# EAGLE design Enable Bus Circuit (EAGLE 7.5.0)
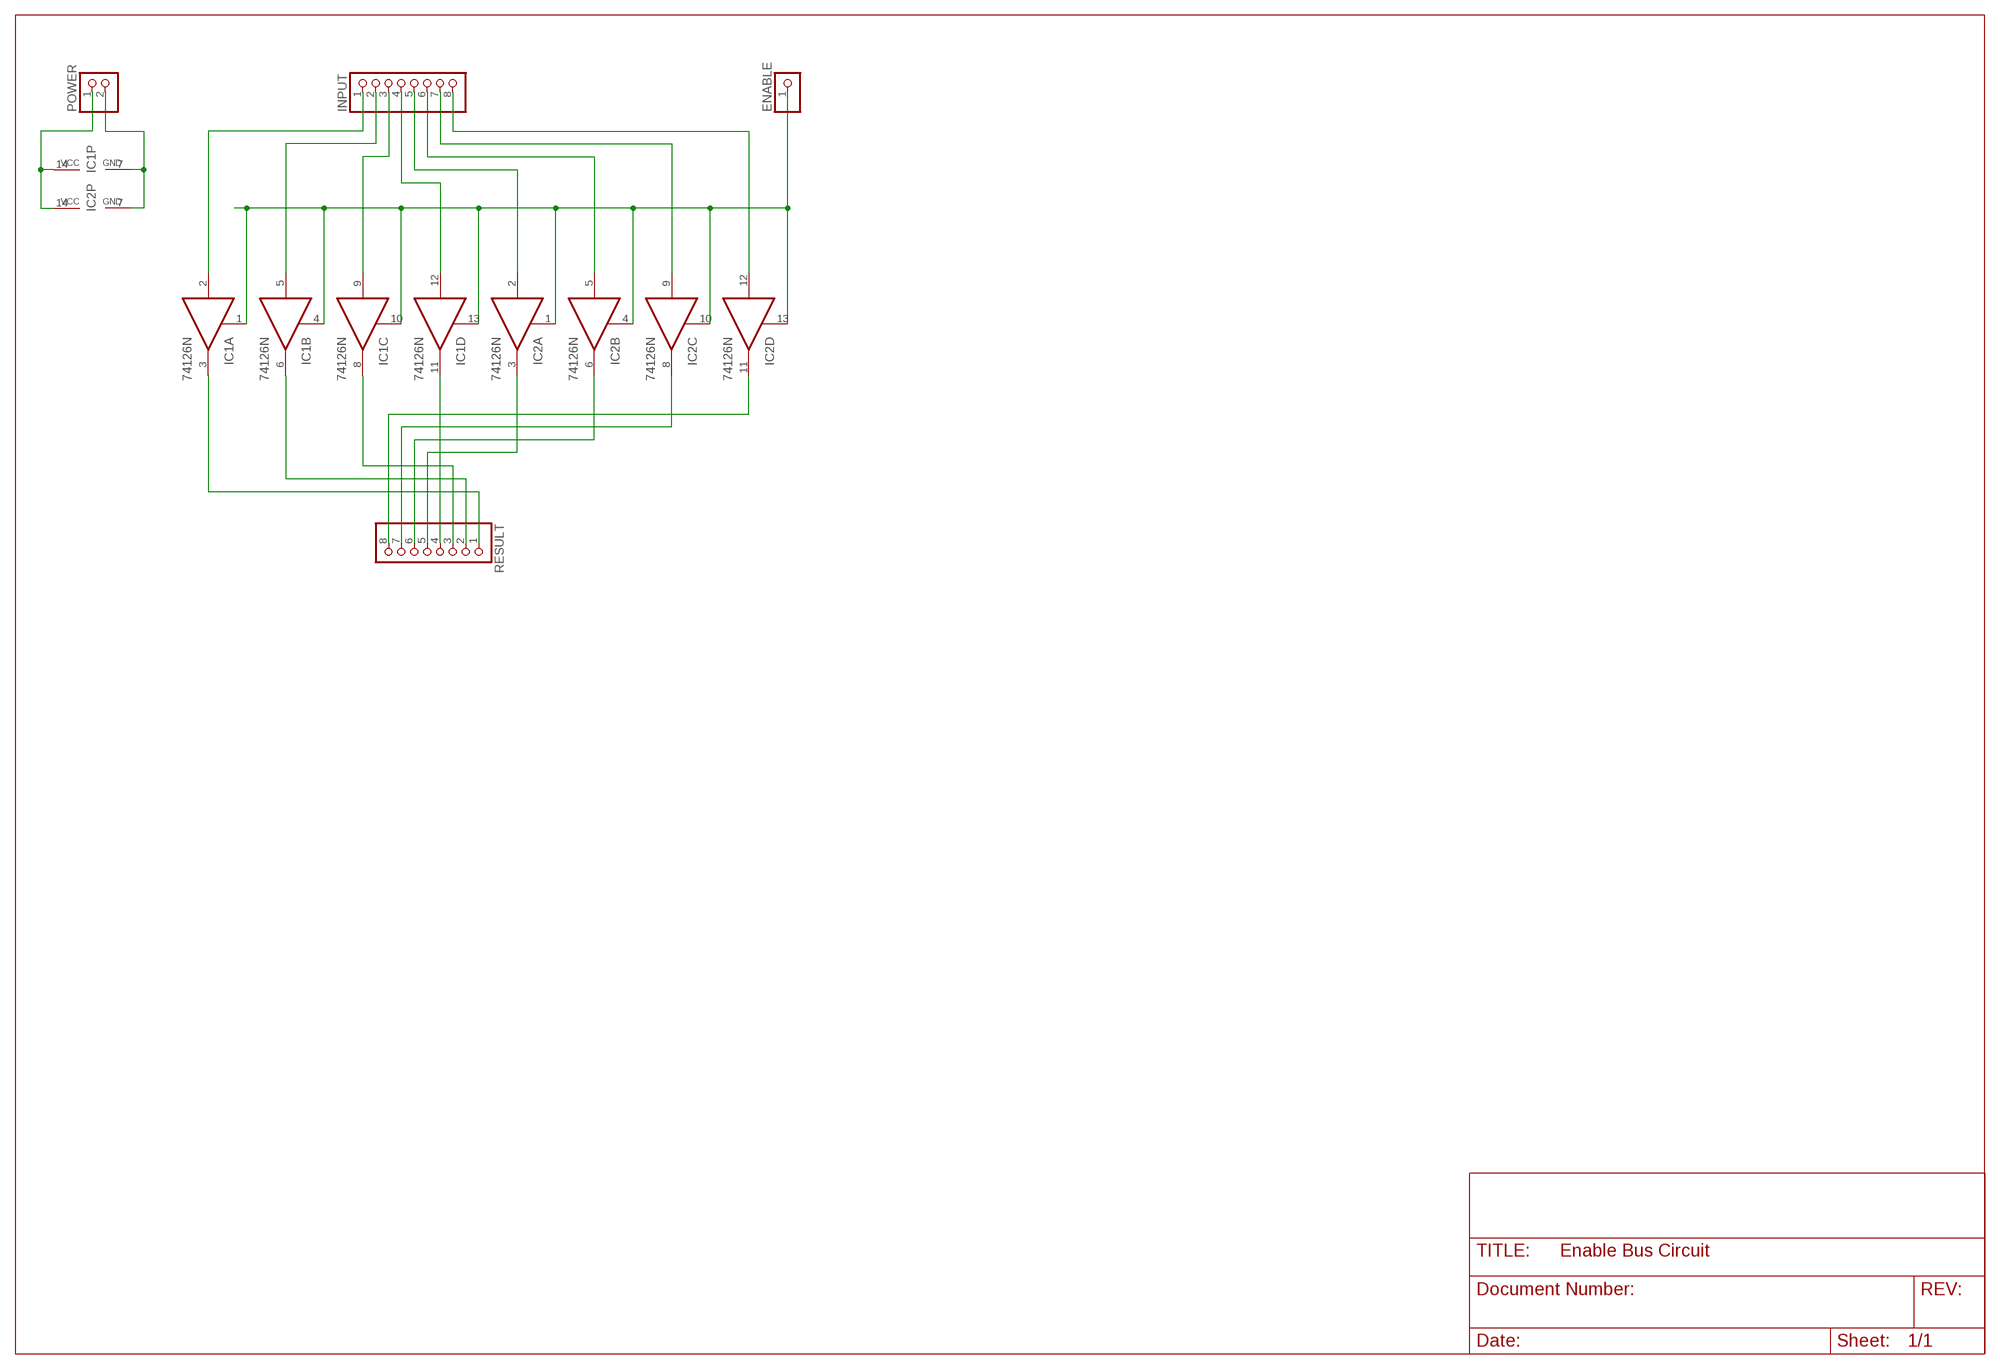
[diagram p0: schematic, sheet 1]

## Parts
ENABLE  PINHD-1X1  [1X01]
IC1  74126N  [DIL14]
IC2  74126N  [DIL14]
INPUT  PINHD-1X8  [1X08]
POWER  PINHD-1X2  [1X02]
RESULT  PINHD-1X8  [1X08]

## Nets
GND: IC1.7(P:GND) IC2.7(P:GND) POWER.2
N$1: IC1.2(A:I) INPUT.1
N$2: IC1.5(B:I) INPUT.2
N$3: IC1.9(C:I) INPUT.3
N$4: IC1.12(D:I) INPUT.4
N$5: IC2.2(A:I) INPUT.5
N$6: IC2.5(B:I) INPUT.6
N$7: IC2.9(C:I) INPUT.7
N$8: IC2.12(D:I) INPUT.8
N$9: ENABLE.1 IC1.1(A:OE) IC1.4(B:OE) IC1.10(C:OE) IC1.13(D:OE) IC2.1(A:OE) IC2.4(B:OE) IC2.10(C:OE) IC2.13(D:OE)
N$10: IC1.3(A:O) RESULT.1
N$11: IC1.6(B:O) RESULT.2
N$12: IC1.8(C:O) RESULT.3
N$13: IC2.11(D:O) RESULT.8
N$14: IC2.3(A:O) RESULT.5
N$15: IC2.6(B:O) RESULT.6
N$16: IC2.8(C:O) RESULT.7
N$18: IC1.11(D:O) RESULT.4
VCC: IC1.14(P:VCC) IC2.14(P:VCC) POWER.1

## Library data of the parts
ENABLE = pinhead:PINHD-1X1: PIN HEADER
IC1 IC2 = 74xx-eu:74*126: Quad bus BUFFER, 3-state
INPUT RESULT = pinhead:PINHD-1X8: PIN HEADER
POWER = pinhead:PINHD-1X2: PIN HEADER

## Board
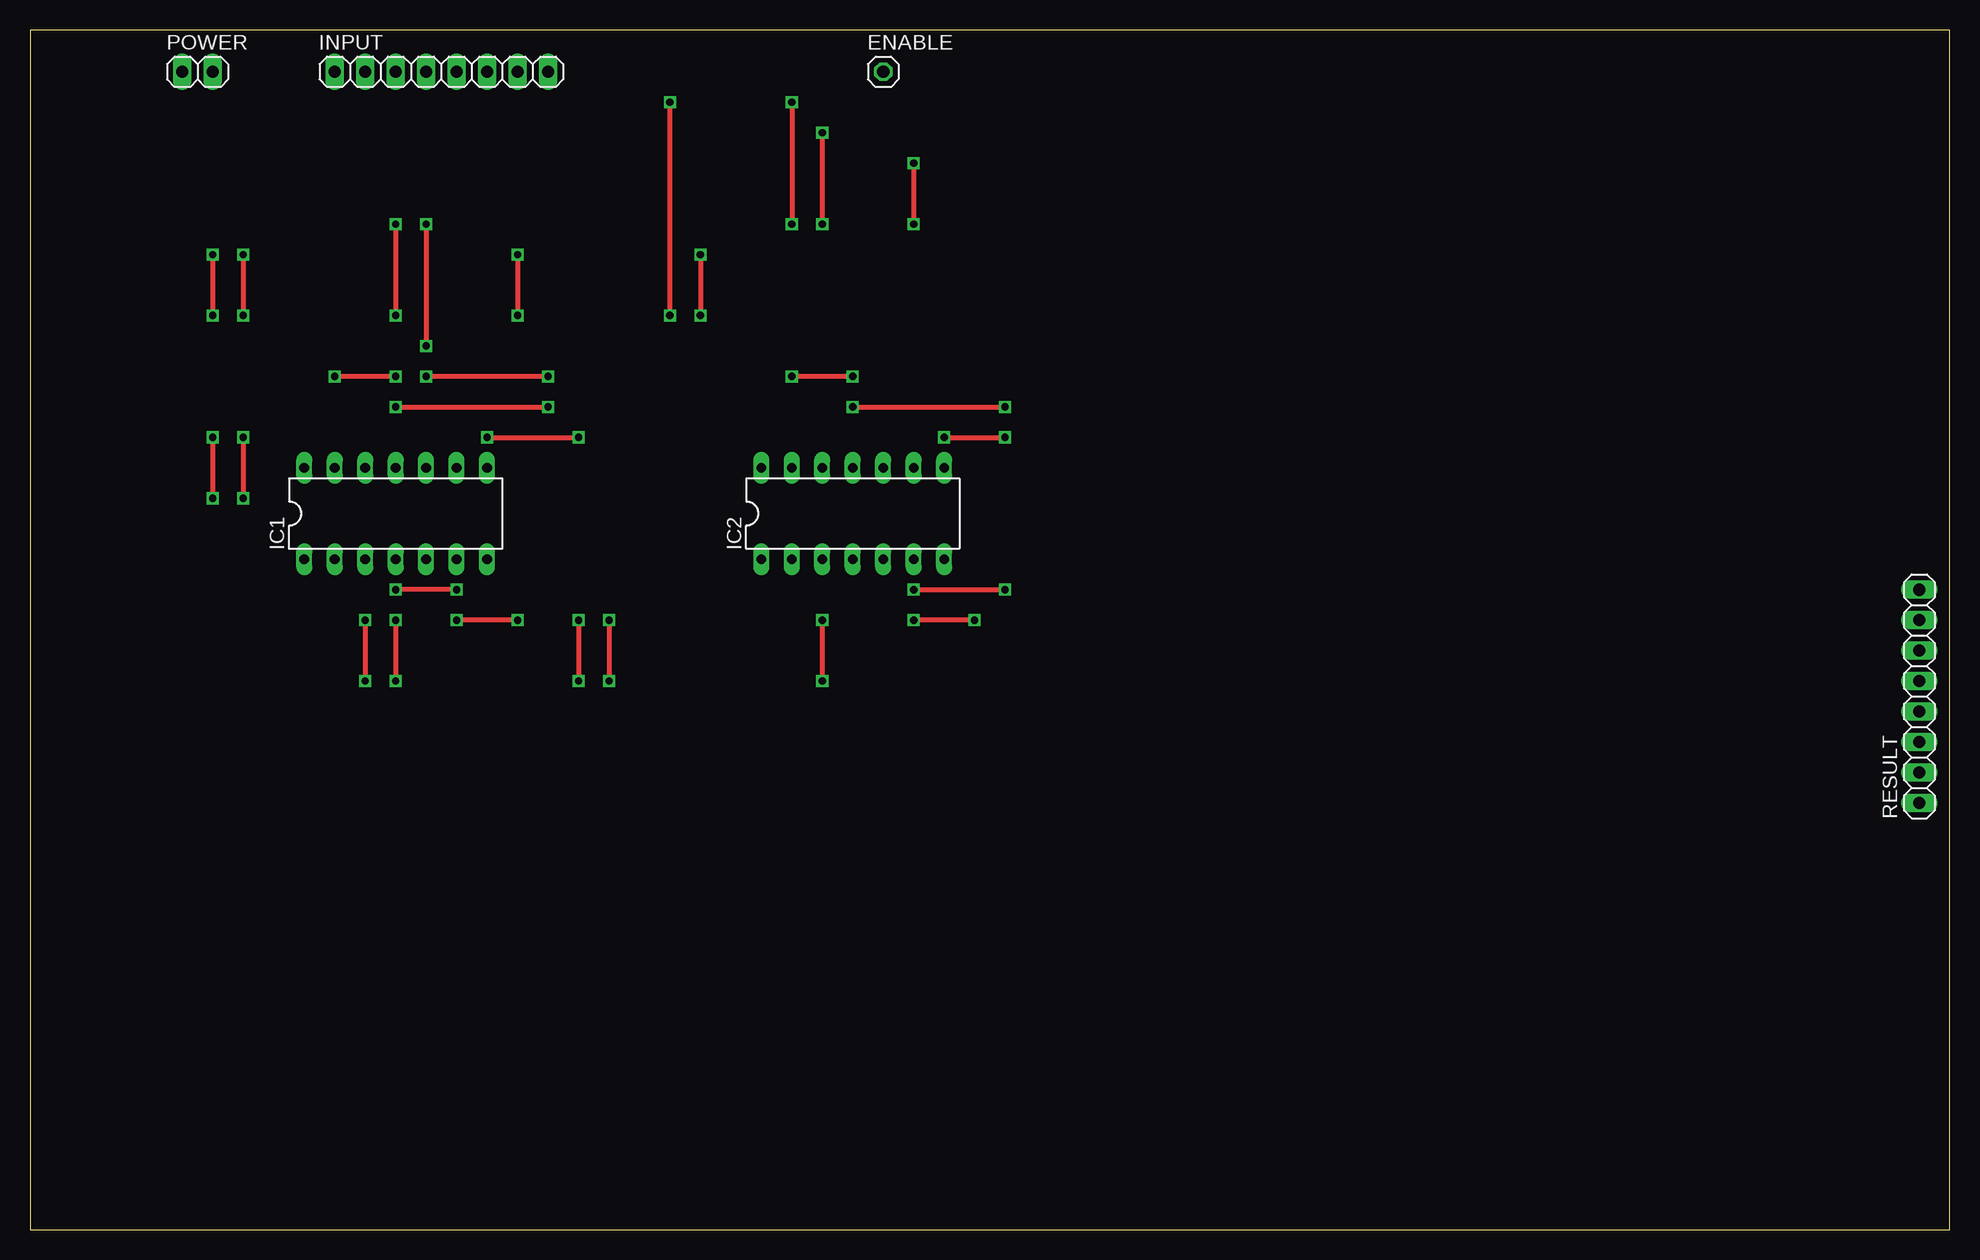
[diagram p1: board, top side]
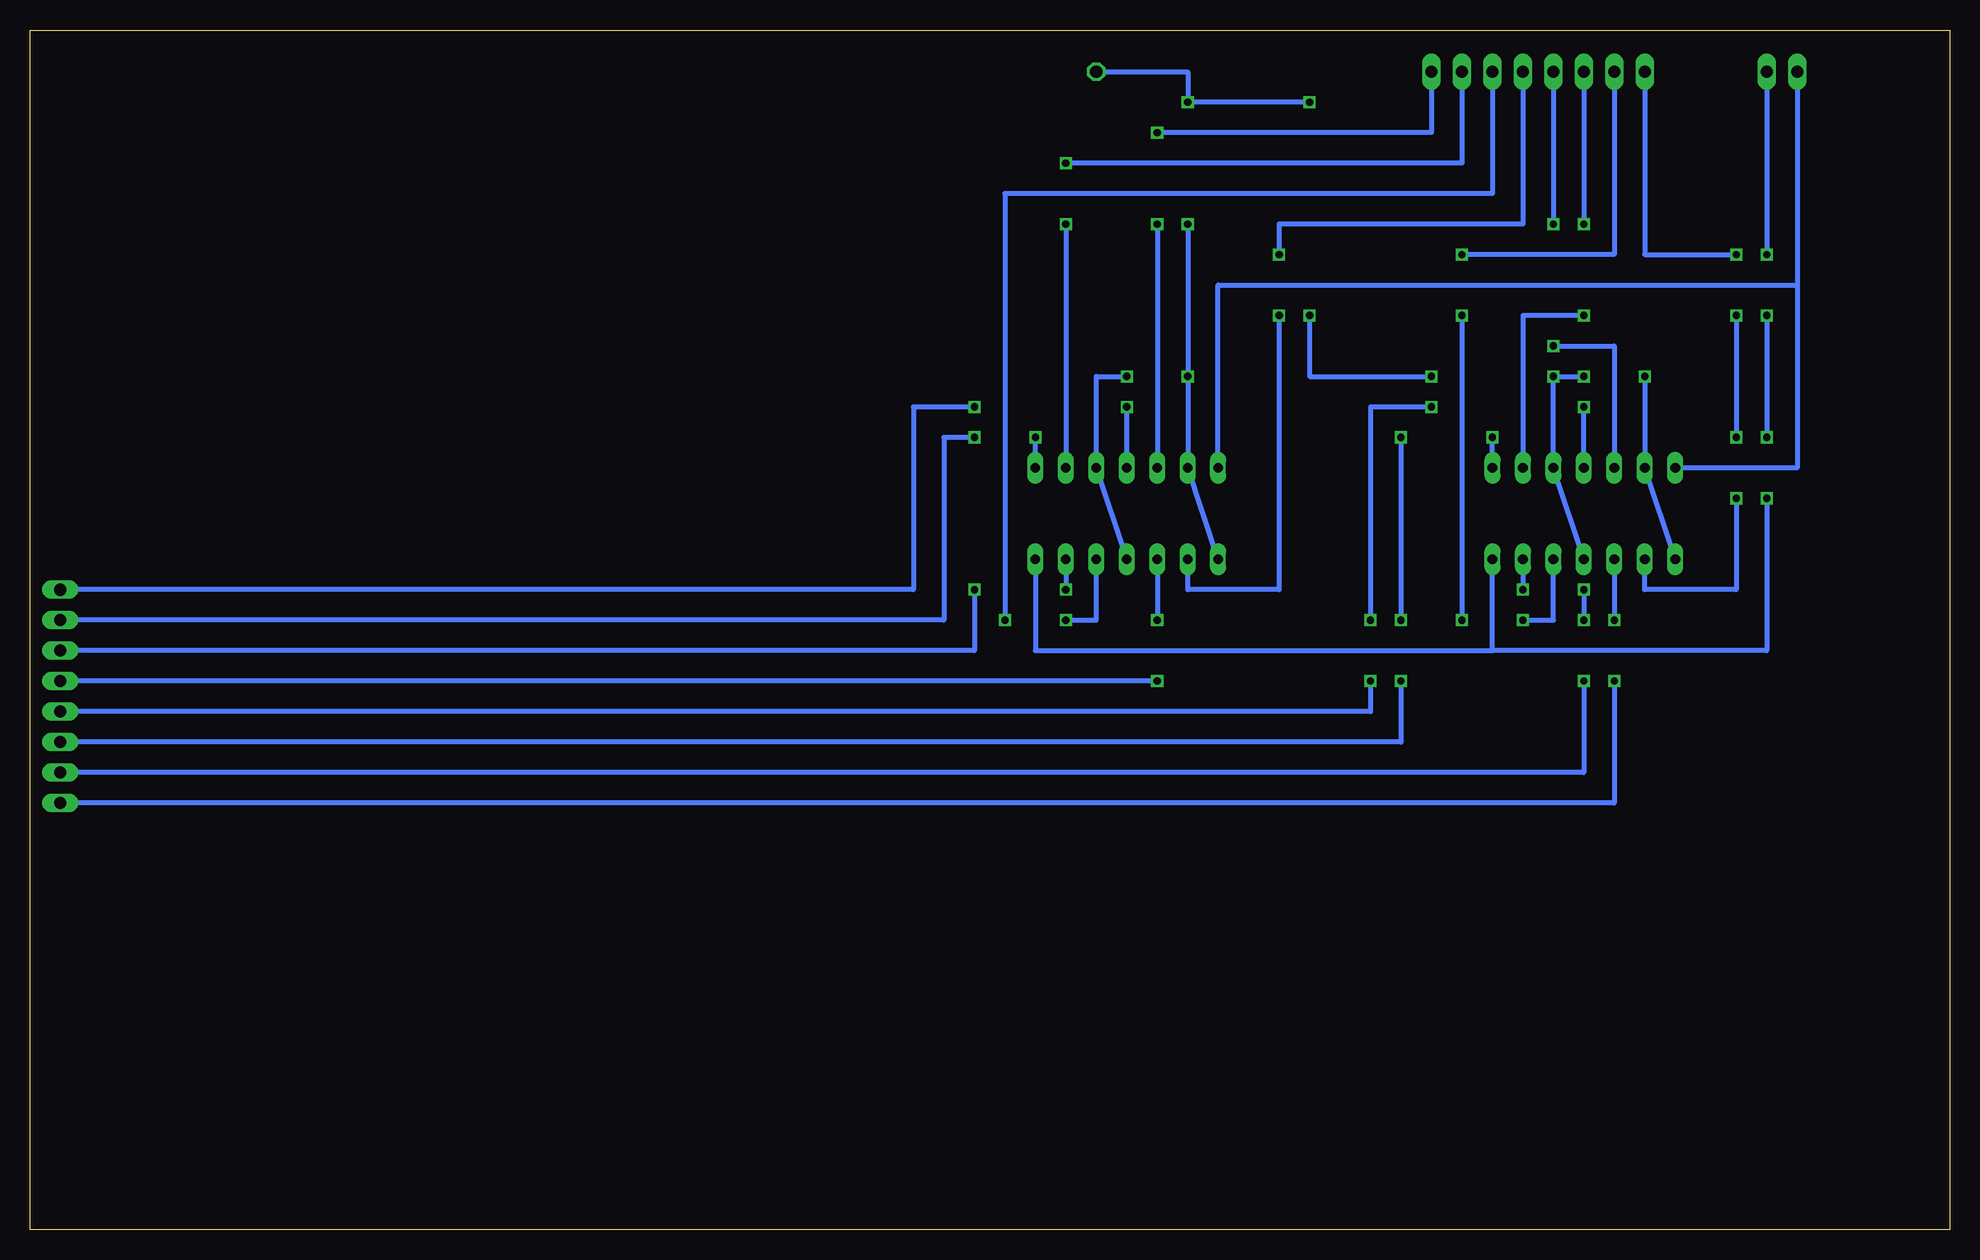
[diagram p2: board, bottom side, seen from below]

Size 160 x 100 mm. Coordinates in mm from the lower left corner, seen from the top.
Outline: 0,0 160,0 160,100 0,100 0,0
Copper layers (1*16): Top 0.035mm / dielectric 1.5mm / Bottom 0.035mm
Design rules "default": minimum track width 10mil, minimum drill 24mil, track to track 8mil, track to pad 8mil, pad to pad 8mil, via to via 8mil, smd to smd 8mil, copper to edge 40mil, drill to drill 8mil, minimum pad ring 10mil, minimum via ring 8mil, stop-mask expansion 4mil, vias tented up to drill 0mil, thermal gap 10mil

### Footprints (pad centres in the part's own frame; a part is rotated, then mirrored left to right if it is on the bottom)
1X01 = drill 1.016 octagon: 1 0,0
DIL14 = drill 0.813 long: 1 -7.62,-3.81; 2 -5.08,-3.81; 3 -2.54,-3.81; 4 0,-3.81; 5 2.54,-3.81; 6 5.08,-3.81; 7 7.62,-3.81; 8 7.62,3.81; 9 5.08,3.81; 10 2.54,3.81; 11 0,3.81; 12 -2.54,3.81; 13 -5.08,3.81; 14 -7.62,3.81
1X08 = drill 1.016 long: 1 -8.89,0; 2 -6.35,0; 3 -3.81,0; 4 -1.27,0; 5 1.27,0; 6 3.81,0; 7 6.35,0; 8 8.89,0
1X02 = drill 1.016 long: 1 -1.27,0; 2 1.27,0

### Placement (x,y rotation side)
ENABLE  71.12,96.52 0 top
IC1  30.48,59.69 0 top
IC2  68.58,59.69 0 top
INPUT  34.29,96.52 0 top
POWER  13.97,96.52 0 top
RESULT  157.48,44.45 90 top

### Tracks (layer width: path | path; a pad name or v marks a point on that pad's centre or on a via)
GND  (via drill 0.6)
  Top 0.406: v15.24,81.28 v15.24,76.2 | v15.24,66.04 v15.24,60.96
  Bottom 0.406: POWER.2 v15.24,81.28 | v15.24,76.2 v15.24,66.04 | v15.24,60.96 15.24,48.26 38.1,48.26 | 38.1,48.26 IC1.7 | IC2.7 76.2,48.26 38.1,48.26
N$1  (via drill 0.6)
  Top 0.406: v17.78,81.28 v17.78,76.2 | v17.78,66.04 v17.78,60.96
  Bottom 0.406: INPUT.1 25.4,81.28 v17.78,81.28 | v17.78,76.2 v17.78,66.04 | v17.78,60.96 17.78,53.34 25.4,53.34 IC1.2
N$2  (via drill 0.6)
  Top 0.406: v40.64,81.28 v40.64,76.2 | v40.64,50.8 v35.56,50.8
  Bottom 0.406: INPUT.2 27.94,81.28 v40.64,81.28 | v40.64,76.2 v40.64,50.8 | v35.56,50.8 33.02,50.8 IC1.5
N$3  (via drill 0.6)
  Top 0.406: v30.48,83.82 v30.48,76.2
  Bottom 0.406: INPUT.3 v30.48,83.82 | v30.48,76.2 35.56,76.2 IC1.9
N$4  (via drill 0.6)
  Top 0.406: v33.02,83.82 v33.02,73.66
  Bottom 0.406: INPUT.4 v33.02,83.82 | v33.02,73.66 27.94,73.66 IC1.12
N$5  (via drill 0.6)
  Top 0.406: v55.88,81.28 v55.88,76.2
  Bottom 0.406: INPUT.5 35.56,83.82 55.88,83.82 v55.88,81.28 | v55.88,76.2 55.88,53.34 63.5,53.34 IC2.2
N$6  (via drill 0.6)
  Top 0.406: v78.74,50.8 v73.66,50.8
  Bottom 0.406: INPUT.6 38.1,86.36 78.74,86.36 v78.74,50.8 | v73.66,50.8 71.12,50.8 IC2.5
N$7  (via drill 0.6)
  Top 0.406: v73.66,88.9 v73.66,83.82
  Bottom 0.406: INPUT.7 40.64,88.9 v73.66,88.9 | v73.66,83.82 IC2.9
N$8  (via drill 0.6)
  Top 0.406: v66.04,91.44 v66.04,83.82
  Bottom 0.406: INPUT.8 43.18,91.44 v66.04,91.44 | v66.04,83.82 IC2.12
N$9  (via drill 0.6)
  Top 0.406: v63.5,93.98 v63.5,83.82 | v68.58,71.12 v63.5,71.12 | v53.34,76.2 v53.34,93.98 | v43.18,71.12 v33.02,71.12 | v30.48,71.12 v25.4,71.12
  Bottom 0.406: ENABLE.1 63.5,96.52 v63.5,93.98 v53.34,93.98 | v63.5,83.82 v63.5,71.12 IC2.13 IC2.1 | v68.58,71.12 71.12,71.12 IC2.10 IC2.4 | IC1.1 IC1.13 v25.4,71.12 | IC1.4 IC1.10 v33.02,71.12 v30.48,71.12 | v53.34,76.2 53.34,71.12 v43.18,71.12
N$10  (via drill 0.6)
  Top 0.406: v27.94,50.8 v27.94,45.72
  Bottom 0.406: IC1.3 v27.94,50.8 | v27.94,45.72 27.94,35.56 RESULT.1
N$11  (via drill 0.6)
  Top 0.406: v35.56,53.34 v30.48,53.34 | v30.48,50.8 v30.48,45.72
  Bottom 0.406: IC1.6 v35.56,53.34 | v30.48,53.34 v30.48,50.8 | v30.48,45.72 30.48,38.1 RESULT.2
N$12  (via drill 0.6)
  Top 0.406: v38.1,66.04 v45.72,66.04 | v45.72,50.8 v45.72,45.72
  Bottom 0.406: IC1.8 v38.1,66.04 | v45.72,66.04 v45.72,50.8 | v45.72,45.72 45.72,40.64 RESULT.3
N$13  (via drill 0.6)
  Top 0.406: v68.58,68.58 v81.28,68.58
  Bottom 0.406: IC2.11 v68.58,68.58 | v81.28,68.58 86.36,68.58 86.36,53.34 RESULT.8
N$14  (via drill 0.6)
  Top 0.406: v66.04,50.8 v66.04,45.72
  Bottom 0.406: IC2.3 v66.04,50.8 | v66.04,45.72 RESULT.5
N$15  (via drill 0.6)
  Top 0.406: v73.66,53.34 v81.28,53.34
  Bottom 0.406: IC2.6 v73.66,53.34 | v81.28,53.34 81.28,48.26 RESULT.6
N$16  (via drill 0.6)
  Top 0.406: v76.2,66.04 v81.28,66.04
  Bottom 0.406: IC2.8 v76.2,66.04 | RESULT.7 83.82,50.8 83.82,66.04 v81.28,66.04
N$18  (via drill 0.6)
  Top 0.406: v30.48,68.58 v43.18,68.58 | v48.26,50.8 v48.26,45.72
  Bottom 0.406: IC1.11 v30.48,68.58 | v43.18,68.58 48.26,68.58 v48.26,50.8 | v48.26,45.72 48.26,43.18 RESULT.4
VCC
  Bottom 0.406: POWER.1 12.7,78.74 | 12.7,78.74 12.7,63.5 IC1.14 | IC2.14 60.96,78.74 12.7,78.74